# EasyEDA schematic 1-Schematic_tiny_bloom.json
TITLE: Tiny_Bloom; REV: 1.0; Date: 2019-01-29; Sheet: 1/1; Drawn By: spoung123; Company: Your Company
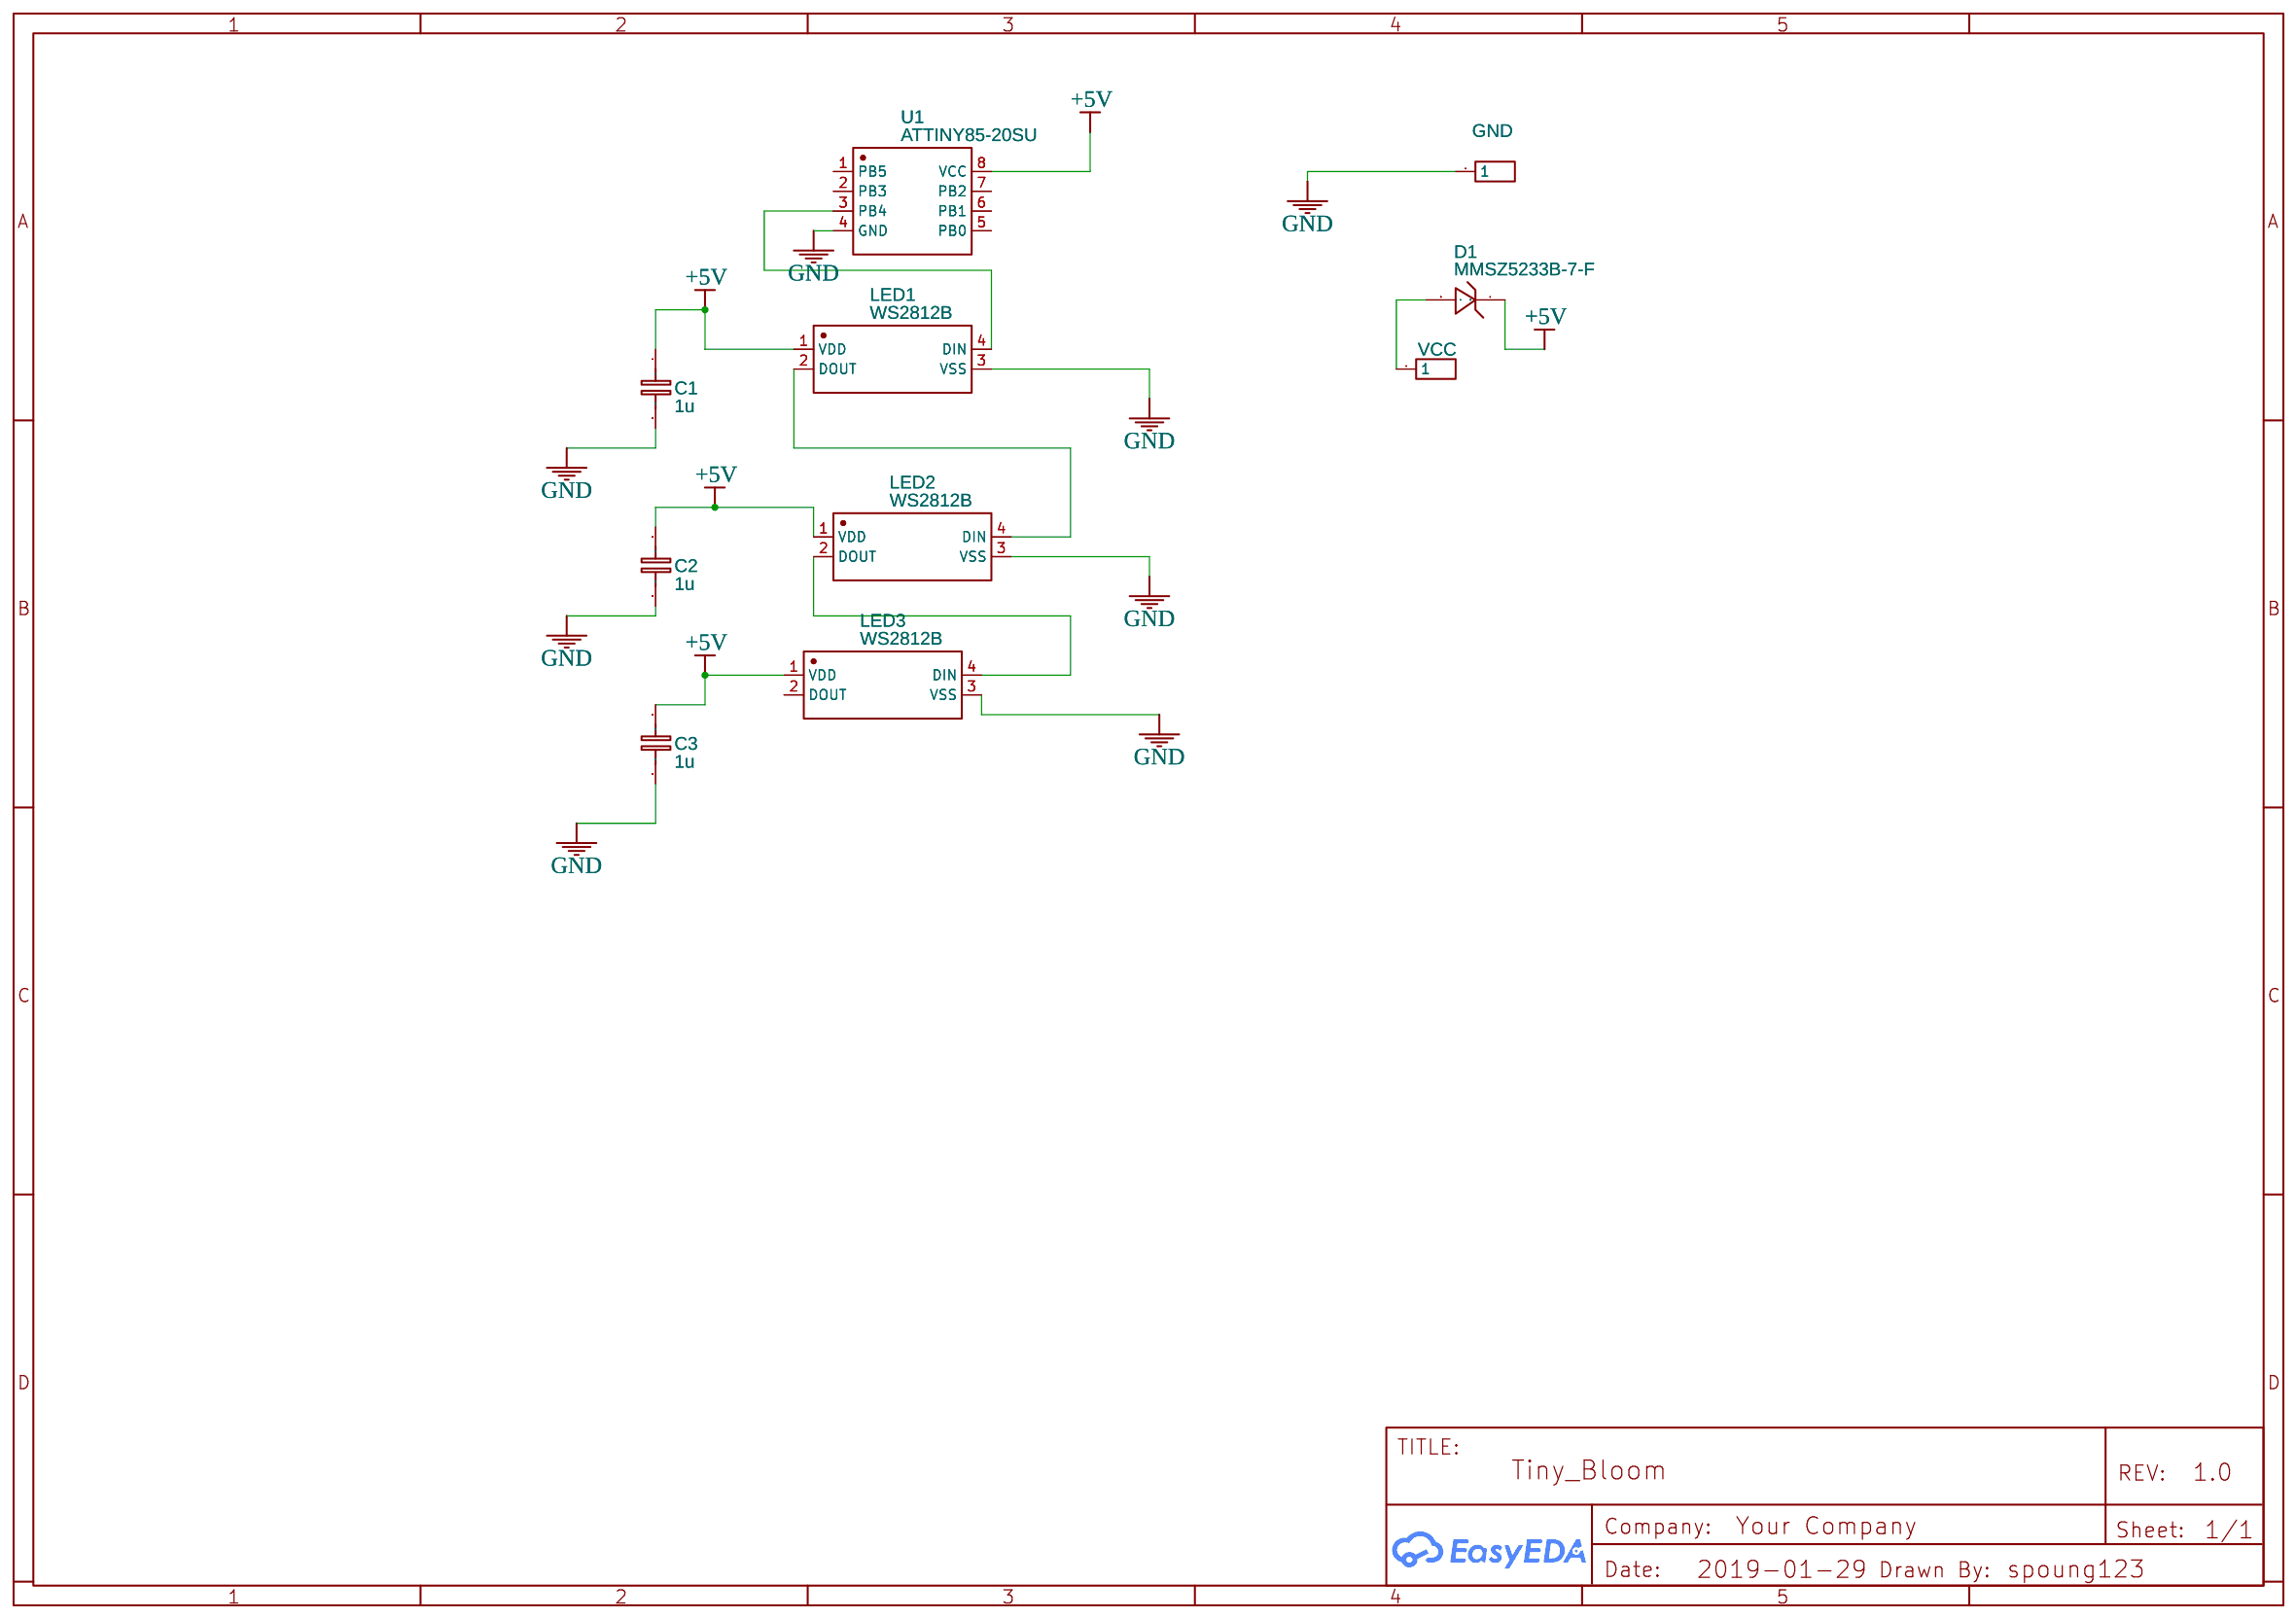
[diagram p0: schematic sheet]

## Parts
C1  1u  [0603]
C2  1u  [0603]
C3  1u  [0603]
D1  MMSZ5233B-7-F  [SOD-123FL]
GND  Header-Male-2.54_1x1  [HDR-1X1/2.54]
LED1  WS2812B  [LED-5050_4P]
LED2  WS2812B  [LED-5050_4P]
LED3  WS2812B  [LED-5050_4P]
U1  ATTINY85-20SU  [SOIC-8_208MIL]
VCC  Header-Male-2.54_1x1  [HDR-1X1/2.54]

## Library data of the parts
C1-C3 = Cap_0603_EU: Manufacturer Part: ?
D1 = -: Supplier Part: C151381; Supplier: LCSC; Manufacturer: DIODES; Contributor: LCSC
GND VCC = -: Supplier: LCSC; Manufacturer: ReliaPro; Supplier Part: C81276
LED1-LED3 = -: Supplier: LCSC; Manufacturer: Worldsemi; Contributor: LCSC; Supplier Part: C114585
U1 = -: Supplier: LCSC; Manufacturer: MICROCHIP; Supplier Part: C89852

## Nets
+5V: C1.1 C2.1 C3.1 D1.1(C) LED1.1(VDD) LED2.1(VDD) LED3.1(VDD) U1.8(VCC)
GND: C1.2 C2.2 C3.2 GND.1 LED1.3(VSS) LED2.3(VSS) LED3.3(VSS) U1.4(GND)
VCC_1: D1.2(A) VCC.1
LED1_2: LED1.2(DOUT) LED2.4(DIN)
LED2_2: LED2.2(DOUT) LED3.4(DIN)
U1_3: LED1.4(DIN) U1.3(PB4)

Not connected (* = marked no-connect by the designer): LED3 2(DOUT); U1 1(PB5) 2(PB3) 5(PB0) 6(PB1) 7(PB2)
